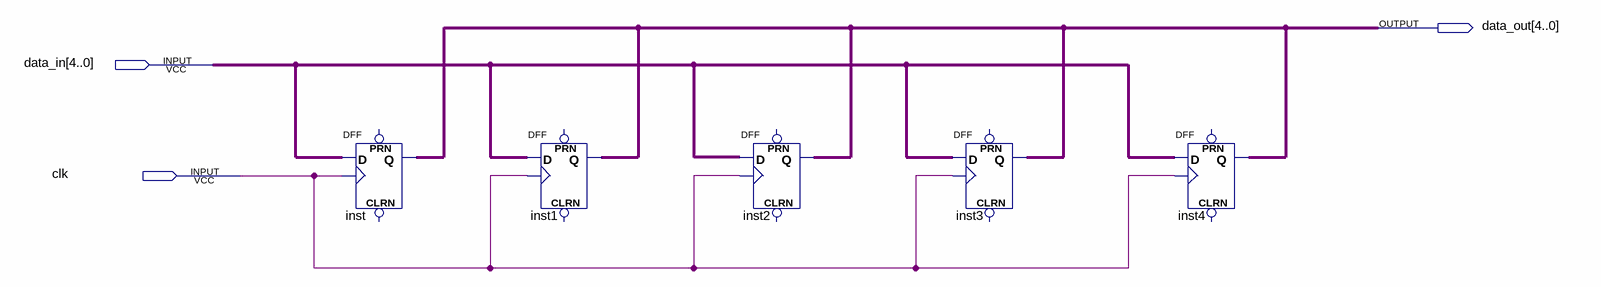
[diagram p0: schematic sheet]
// Quartus schematic reg5.bdf as structural Verilog: 5 symbols, 3 pins
module reg5 (
  input  [4:0] data_in,
  input  clk,
  output [4:0] data_out
);

  DFF inst[4:0] (.CLK(clk), .D(data_in), .Q(data_out));  // open: CLRN, PRN
  DFF inst1[4:0] (.CLK(clk), .D(data_in), .Q(data_out));  // open: CLRN, PRN
  DFF inst2[4:0] (.CLK(clk), .D(data_in), .Q(data_out));  // open: CLRN, PRN
  DFF inst3[4:0] (.CLK(clk), .D(data_in), .Q(data_out));  // open: CLRN, PRN
  DFF inst4[4:0] (.CLK(clk), .D(data_in), .Q(data_out));  // open: CLRN, PRN
endmodule
